# Altium project Marsault1.PrjPcb (part 5 of 7)

## Sheet SENSORS.SchDoc
size A3; SheetNumber: 5; SheetTotal: 9
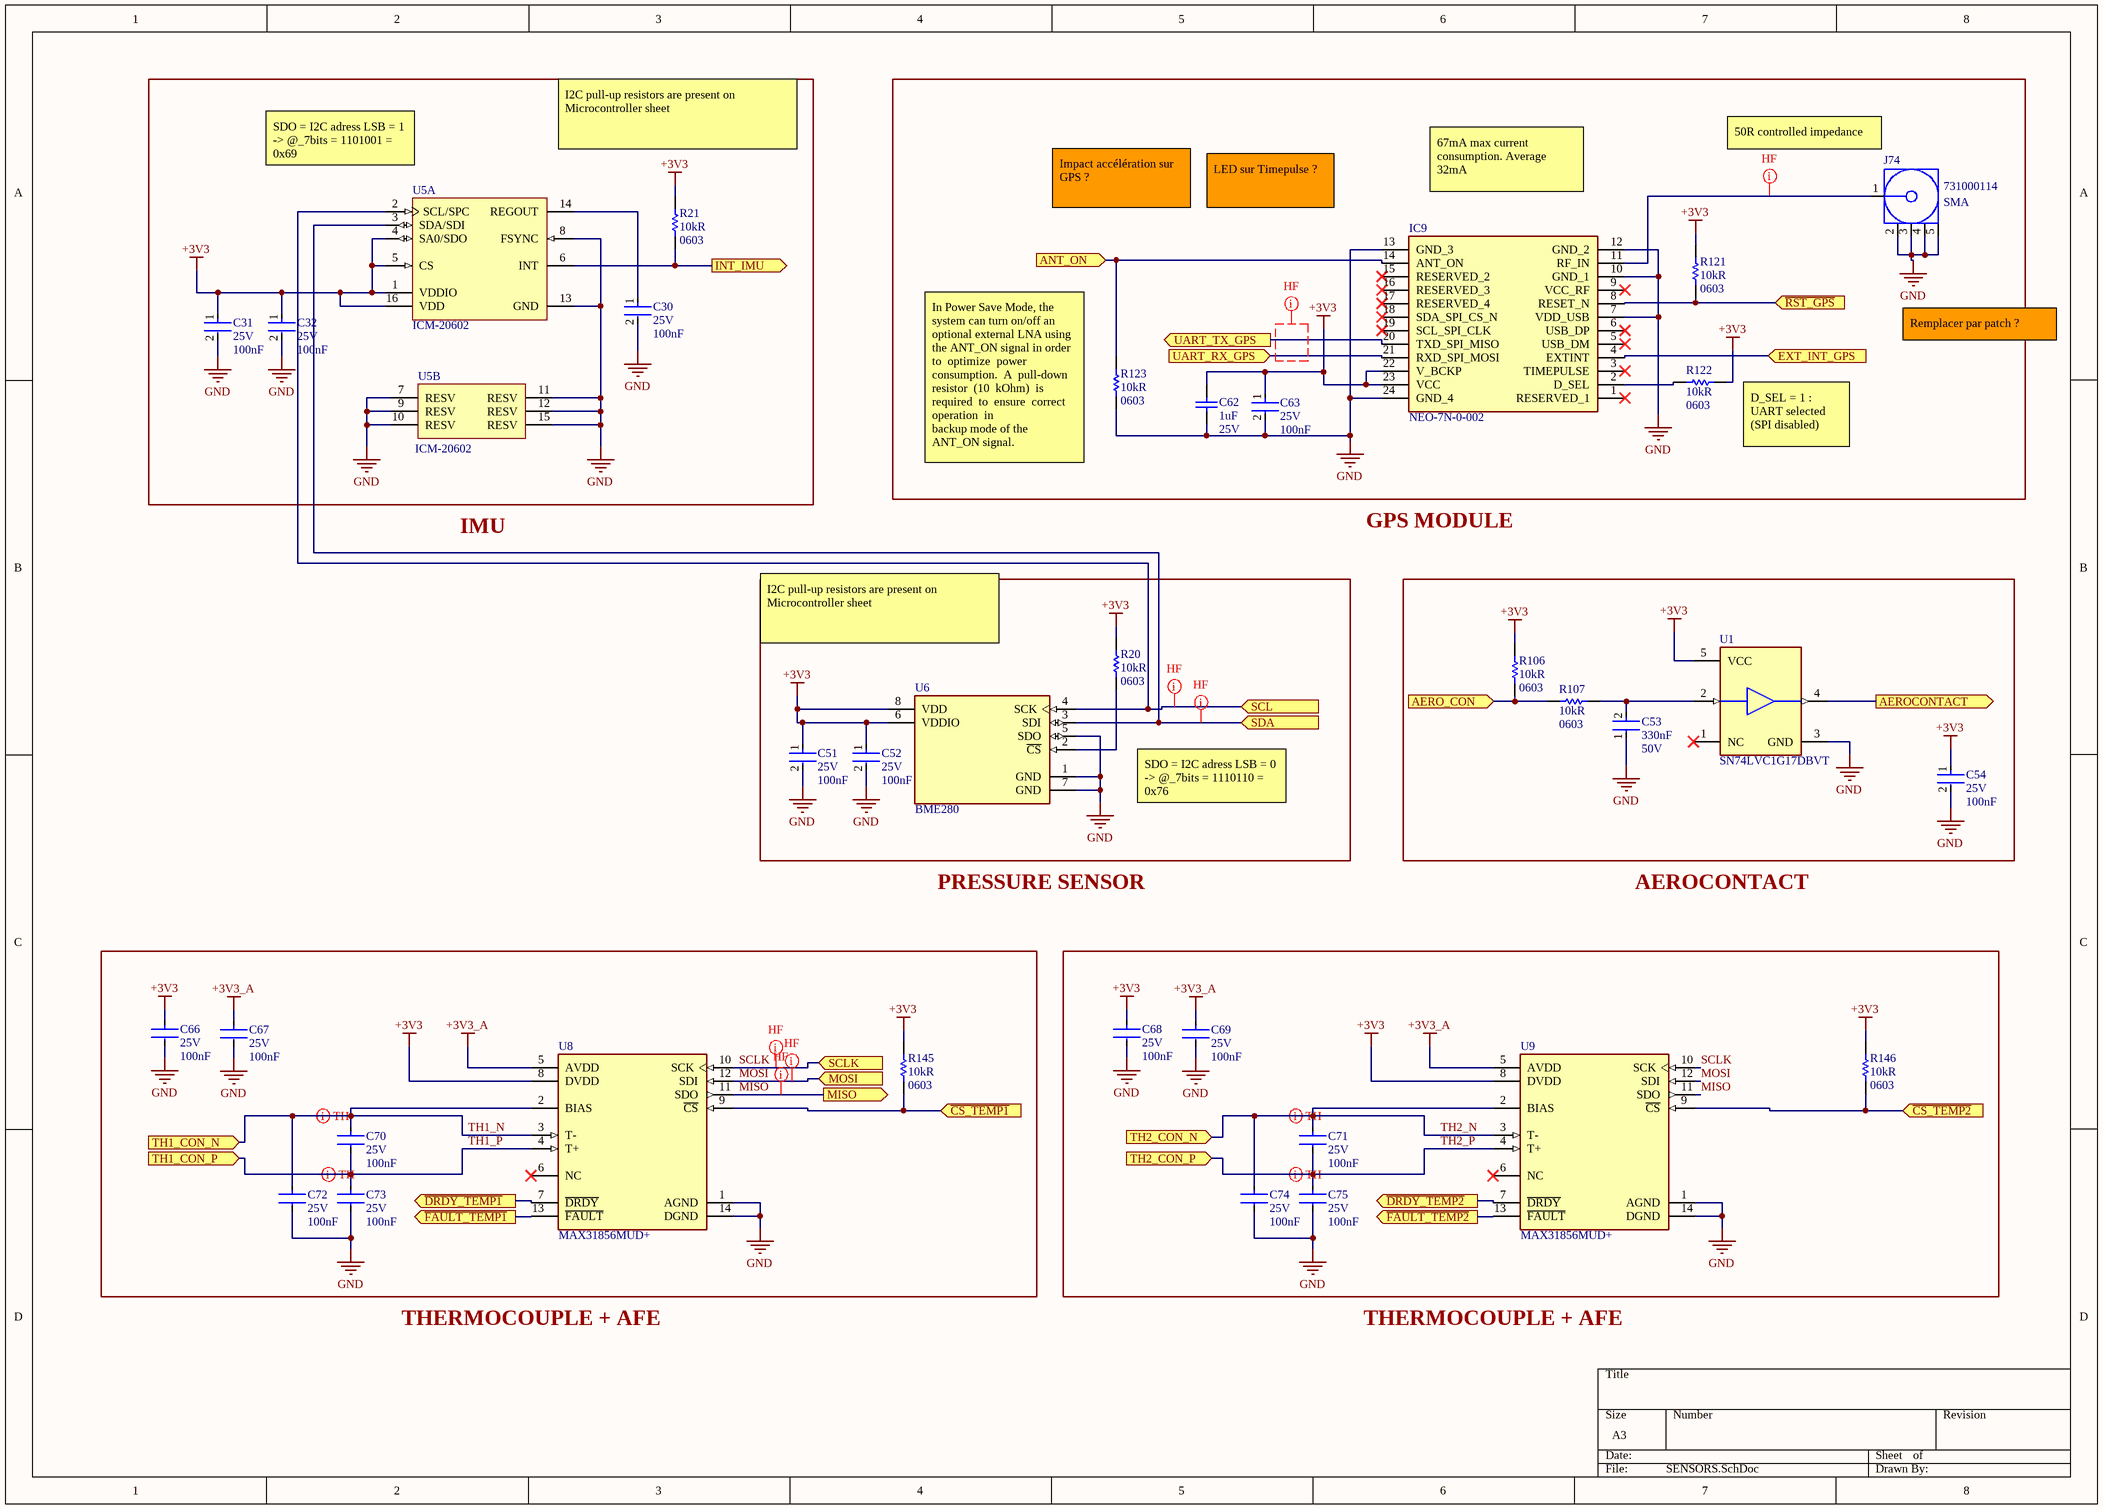
[diagram p4: SENSORS.SchDoc]

### Parts
C30  Voltage Rating (DC): 25V  Capacitance: 100nF  [FP-CGA3E-0_3-0_1-MFG]  (hidden comment: CGA3E2X7R1E104K080AA)
C31  Voltage Rating (DC): 25V  Capacitance: 100nF  [FP-CGA3E-0_3-0_1-MFG]  (hidden comment: CGA3E2X7R1E104K080AA)
C32  Voltage Rating (DC): 25V  Capacitance: 100nF  [FP-CGA3E-0_3-0_1-MFG]  (hidden comment: CGA3E2X7R1E104K080AA)
C51  Voltage Rating (DC): 25V  Capacitance: 100nF  [FP-CGA3E-0_3-0_1-MFG]  (hidden comment: CGA3E2X7R1E104K080AA)
C52  Voltage Rating (DC): 25V  Capacitance: 100nF  [FP-CGA3E-0_3-0_1-MFG]  (hidden comment: CGA3E2X7R1E104K080AA)
C53  Capacitance: 330nF  Voltage Rating: 50V  [FP-C1608-080-0_1-IPC_B]  (hidden comment: C1608X7R1H334K080AC)
C54  Voltage Rating (DC): 25V  Capacitance: 100nF  [FP-CGA3E-0_3-0_1-MFG]  (hidden comment: CGA3E2X7R1E104K080AA)
C62  Capacitance: 1uF  Voltage Rating (DC): 25V  [CAPC1608X90X35LL15T15]  (hidden comment: C0603C105K3PAC7867)
C63  Voltage Rating (DC): 25V  Capacitance: 100nF  [FP-CGA3E-0_3-0_1-MFG]  (hidden comment: CGA3E2X7R1E104K080AA)
C66  Voltage Rating (DC): 25V  Capacitance: 100nF  [FP-CGA3E-0_3-0_1-MFG]  (hidden comment: CGA3E2X7R1E104K080AA)
C67  Voltage Rating (DC): 25V  Capacitance: 100nF  [FP-CGA3E-0_3-0_1-MFG]  (hidden comment: CGA3E2X7R1E104K080AA)
C68  Voltage Rating (DC): 25V  Capacitance: 100nF  [FP-CGA3E-0_3-0_1-MFG]  (hidden comment: CGA3E2X7R1E104K080AA)
C69  Voltage Rating (DC): 25V  Capacitance: 100nF  [FP-CGA3E-0_3-0_1-MFG]  (hidden comment: CGA3E2X7R1E104K080AA)
C70  Voltage Rating (DC): 25V  Capacitance: 100nF  [FP-CGA3E-0_3-0_1-MFG]  (hidden comment: CGA3E2X7R1E104K080AA)
C71  Voltage Rating (DC): 25V  Capacitance: 100nF  [FP-CGA3E-0_3-0_1-MFG]  (hidden comment: CGA3E2X7R1E104K080AA)
C72  Voltage Rating (DC): 25V  Capacitance: 100nF  [FP-CGA3E-0_3-0_1-MFG]  (hidden comment: CGA3E2X7R1E104K080AA)
C73  Voltage Rating (DC): 25V  Capacitance: 100nF  [FP-CGA3E-0_3-0_1-MFG]  (hidden comment: CGA3E2X7R1E104K080AA)
C74  Voltage Rating (DC): 25V  Capacitance: 100nF  [FP-CGA3E-0_3-0_1-MFG]  (hidden comment: CGA3E2X7R1E104K080AA)
C75  Voltage Rating (DC): 25V  Capacitance: 100nF  [FP-CGA3E-0_3-0_1-MFG]  (hidden comment: CGA3E2X7R1E104K080AA)
IC9  NEO-7N-0-002  [NEO7N0002]
J74  731000114  Case/Package: SMA  [MOLX-731000114_V]
R20  Resistance: 10kR  Case Code (Imperial): 0603  [RESC1609X55X30LL15T15]  (hidden comment: ERJ3EKF1002V)
R21  Resistance: 10kR  Case Code (Imperial): 0603  [RESC1609X55X30LL15T15]  (hidden comment: ERJ3EKF1002V)
R106  Resistance: 10kR  Case Code (Imperial): 0603  [RESC1609X55X30LL15T15]  (hidden comment: ERJ3EKF1002V)
R107  Resistance: 10kR  Case Code (Imperial): 0603  [RESC1609X55X30LL15T15]  (hidden comment: ERJ3EKF1002V)
R121  Resistance: 10kR  Case Code (Imperial): 0603  [RESC1609X55X30LL15T15]  (hidden comment: ERJ3EKF1002V)
R122  Resistance: 10kR  Case Code (Imperial): 0603  [RESC1609X55X30LL15T15]  (hidden comment: ERJ3EKF1002V)
R123  Resistance: 10kR  Case Code (Imperial): 0603  [RESC1609X55X30LL15T15]  (hidden comment: ERJ3EKF1002V)
R145  Resistance: 10kR  Case Code (Imperial): 0603  [RESC1609X55X30LL15T15]  (hidden comment: ERJ3EKF1002V)
R146  Resistance: 10kR  Case Code (Imperial): 0603  [RESC1609X55X30LL15T15]  (hidden comment: ERJ3EKF1002V)
U1  SN74LVC1G17DBVT  [FP-DBV0005A-MFG]
U5  ICM-20602  [INSE-I62-16]  (parts A,B of 2)
U6  BME280  [FP-BME280-MFG]
U8  MAX31856MUD+  [FP-U14-2-MFG]
U9  MAX31856MUD+  [FP-U14-2-MFG]

### Ports
AERO_CON (in), AEROCONTACT (out), ANT_ON (in), EXT_INT_GPS (in), INT_IMU (out), MISO (out), MOSI (in), SCL (in), SCLK (in), SDA (in), TH1_CON_N (in), TH1_CON_P (in), TH2_CON_N (in), TH2_CON_P (in), UART_RX_GPS (in), UART_TX_GPS (out), ~{CS_TEMP1} (in), ~{CS_TEMP2} (in), ~{DRDY_TEMP1} (out), ~{DRDY_TEMP2} (out), ~{FAULT_TEMP1} (out), ~{FAULT_TEMP2} (out), ~{RST_GPS} (in)

### Nets
+3V3: C31.1 C32.1 C51.1 C52.1 C54.1 C62.2 C63.1 C66.1 C68.1 IC9.22(V_BCKP) IC9.23(VCC) R20.2 R21.2 R106.2 R121.2 R122.2 R145.2 R146.2 U1.5(VCC) U5.1(VDDIO) U5.4(SA0/SDO) U5.5(CS) U5.16(VDD) U6.6(VDDIO) U6.8(VDD) U8.8(DVDD) U9.8(DVDD)
+3V3_A: C67.1 C69.1 U8.5(AVDD) U9.5(AVDD)
GND: C30.2 C31.2 C32.2 C51.2 C52.2 C53.1 C54.2 C62.1 C63.2 C66.2 C67.2 C68.2 C69.2 C72.2 C73.2 C74.2 C75.2 IC9.7(VDD_USB) IC9.10(GND_1) IC9.12(GND_2) IC9.13(GND_3) IC9.24(GND_4) J74.2 J74.3 J74.4 J74.5 R123.1 U1.3(GND) U5.7(RESV) U5.8(FSYNC) U5.9(RESV) U5.10(RESV) U5.11(RESV) U5.12(RESV) U5.13(GND) U5.15(RESV) U6.1(GND) U6.5(SDO) U6.7(GND) U8.1(AGND) U8.14(DGND) U9.1(AGND) U9.14(DGND)
~{CS_TEMP1}: R145.1 U8.9(~{CS}) ; port ~{CS_TEMP1}
~{CS_TEMP2}: R146.1 U9.9(~{CS}) ; port ~{CS_TEMP2}
~{DRDY_TEMP1}: U8.7(~{DRDY}) ; port ~{DRDY_TEMP1}
~{DRDY_TEMP2}: U9.7(~{DRDY}) ; port ~{DRDY_TEMP2}
~{FAULT_TEMP1}: U8.13(~{FAULT}) ; port ~{FAULT_TEMP1}
~{FAULT_TEMP2}: U9.13(~{FAULT}) ; port ~{FAULT_TEMP2}
AERO_CON: R106.1 R107.2 ; port AERO_CON
AEROCONTACT: U1.4(Y) ; port AEROCONTACT
INT_IMU: R21.1 U5.6(INT) ; port INT_IMU
MISO: U8.11(SDO) U9.11(SDO) ; port MISO
MOSI: U8.12(SDI) U9.12(SDI) ; port MOSI
SCLK: U8.10(SCK) U9.10(SCK) ; port SCLK
TH1_N: C70.1 C72.1 U8.2(BIAS) U8.3(T-) ; port TH1_CON_N  [project net TH1_CON_N]
TH1_P: C70.2 C73.1 U8.4(T+) ; port TH1_CON_P  [project net TH1_CON_P]
TH2_N: C71.1 C74.1 U9.2(BIAS) U9.3(T-) ; port TH2_CON_N  [project net TH2_CON_N]
TH2_P: C71.2 C75.1 U9.4(T+) ; port TH2_CON_P  [project net TH2_CON_P]
NetC30_1: C30.1 U5.14(REGOUT)
NetC53_2: C53.2 R107.1 U1.2(A)
NetIC9_2: IC9.2(D_SEL) R122.1
NetIC9_4: IC9.4(EXTINT) ; port EXT_INT_GPS
NetIC9_8: IC9.8(RESET_N) R121.1 ; port ~{RST_GPS}
NetIC9_11: IC9.11(RF_IN) J74.1
NetIC9_14: IC9.14(ANT_ON) R123.2 ; port ANT_ON
NetIC9_20: IC9.20(TXD_SPI_MISO) ; port UART_TX_GPS
NetIC9_21: IC9.21(RXD_SPI_MOSI) ; port UART_RX_GPS
NetR20_1: R20.1 U6.2(~{CS})
NetR26_2: U5.2(SCL/SPC) U6.4(SCK) ; port SCL
NetR28_2: U5.3(SDA/SDI) U6.3(SDI) ; port SDA

Not connected (* = marked no-connect by the designer): IC9 1(RESERVED_1)* 3(TIMEPULSE)* 5(USB_DM)* 6(USB_DP)* 9(VCC_RF)* 15(RESERVED_2)* 16(RESERVED_3)* 17(RESERVED_4)* 18(SDA_SPI_CS_N)* 19(SCL_SPI_CLK)*; U1 1(NC)*; U8 6(NC)*; U9 6(NC)*

### Layout directives
net class HF: (no net found under the mark), MISO, MOSI, NetIC9_11, NetR26_2, NetR28_2, SCLK
differential pair; differential pair class TH: TH1_CON_N, TH1_CON_P, TH2_CON_N, TH2_CON_P

### Notes on the sheet
- (near U5) SDO = I2C adress LSB = 1 -> @_7bits = 1101001 = 0x69
- I2C pull-up resistors are present on Microcontroller sheet
- (near J74) 50R controlled impedance
- Impact accélération sur GPS ?
- LED sur Timepulse ?
- 67mA max current consumption. Average 32mA
- Remplacer par patch ?
- (near R122) D_SEL = 1 : UART selected (SPI disabled)
- (near R123) In Power Save Mode, the system can turn on/off an optional external LNA using the ANT_ON signal in order
  to  optimize  power  consumption.  A  pull-down  resistor  (10  kOhm)  is  required  to  ensure  correct  operation  in
  backup mode of the ANT_ON signal.
- GPS MODULE
- IMU
- SDO = I2C adress LSB = 0 -> @_7bits = 1110110 = 0x76
- PRESSURE SENSOR
- AEROCONTACT
- THERMOCOUPLE + AFE

### Library data of the parts
C30-C32 C51 C52 C54 C63 C66-C75 = CMP-08246-002186-1: Cap Ceramic 100nF 25V X7R 10% Pad SMD 0603 +125°C Automotive T/R; Manufacturer: TDK; Composition: Ceramic; Dielectric: X7R; Ratings: AEC-Q200; Length: 1.6mm; REACH SVHC: No SVHC; Width: 0.031inch; Packaging: Tape and Reel; Case/Package: 0603; Height: 0.8mm; Termination: SMD/SMT; Max Operating Temperature: 125°C; Thickness: 0.035inch; Case Code (Metric): 1608; Lead Free: Lead Free; Mount: Surface Mount; Voltage Rating: 25V; Tolerance: 10%; Weight: 7.1E-05oz; Min Operating Temperature: -55°C; Package Quantity: 1; Depth: 0.8mm; Case Code (Imperial): 0603; Supplier 1: Mouser; Supplier Part Number 1: 810-CGA3E2X7R1E104K; Manufacturer Part Number: CGA3E2X7R1E104K080AA; RoHS: Yes; Category: Ceramic Capacitors; Stock 1: 488891; Pricing 1: 1=0,12000, 10=0,05600, 50=0,05600, 100=0,02500, 1000=0,01400, 10000=0,01000 (USD); Series: CGA; Resistor Type: Ceramic; RoHS Compliant: Yes; ComponentLink1URL: https://datasheet.ciiva.com/24220/cga3e2x7r1e104k080aa-265934-24220022.pdf?src-supplier=Mouser; ComponentLink1Description: https://datasheet.ciiva.com/24220/cga3e2x7r1e104k080aa-265934-24220022.pdf?src-supplier=Mouser; ComponentLink2URL: https://datasheet.ciiva.com/22725/1735392-22725638.pdf?src-supplier=Element14; ComponentLink2Description: https://datasheet.ciiva.com/22725/1735392-22725638.pdf?src-supplier=Element14; ComponentLink3URL: https://datasheet.ciiva.com/22725/1735392-22725639.pdf?src-supplier=Element14; ComponentLink3Description: https://datasheet.ciiva.com/22725/1735392-22725639.pdf?src-supplier=Element14; ComponentLink4URL: https://datasheet.ciiva.com/16427/mlccspec-automotive-general-midvoltage-en-16427320.pdf?src-supplier=Future+Electronics; ComponentLink4Description: https://datasheet.ciiva.com/16427/mlccspec-automotive-general-midvoltage-en-16427320.pdf?src-supplier=Future+Electronics; ComponentLink5URL: https://datasheet.ciiva.com/23803/1735392-23803082.pdf?src-supplier=Newark; ComponentLink5Description: https://datasheet.ciiva.com/23803/1735392-23803082.pdf?src-supplier=Newark
C53 = CMP-2000-07551-2: Multilayer Ceramic Capacitors 330nF ±10% 50V X7R SMD 0603; Manufacturer: TDK; Case Code (Imperial): 0603; Case Code (Metric): 1608; Dielectric: X7R; Length: 1.6mm; Construction: Flat; Resistor Type: Ceramic; Mount: Surface Mount; Packaging: Tape and Reel; Series: C; Case/Package: 0603; Lead Free: Lead Free; Tolerance: 10%; Voltage: 50V; REACH SVHC: No SVHC; Height: 0.8mm; Weight: 7.1E-05oz; Termination: SMD/SMT; Max Operating Temperature: 125°C; RoHS Compliant: Yes; Min Operating Temperature: -55°C; Depth: 0.8mm; Package Quantity: 1; Thickness: 0.037inch; Voltage Rating (DC): 50V; Dielectric Material: Ceramic; Width: 0.031inch; Supplier 1: Mouser; Supplier Part Number 1: 810-C1608X7R1H334K; Manufacturer Part Number: C1608X7R1H334K080AC; RoHS: Yes; Category: Ceramic Capacitors; Stock 1: 79489; Pricing 1: 1=0,25000, 10=0,11500, 50=0,11500, 100=0,09700, 1000=0,06000, 10000=0,05000 (USD); ComponentLink1URL: https://datasheet.ciiva.com/22718/1796654-22718021.pdf?src-supplier=Element14; ComponentLink1Description: https://datasheet.ciiva.com/22718/1796654-22718021.pdf?src-supplier=Element14; ComponentLink2URL: https://datasheet.ciiva.com/6290/tdkmlcccaprange-6290791.pdf?src-supplier=Digi-Key; ComponentLink2Description: https://datasheet.ciiva.com/6290/tdkmlcccaprange-6290791.pdf?src-supplier=Digi-Key; ComponentLink3URL: https://datasheet.ciiva.com/16427/general-b11-16427753.pdf?src-supplier=Future+Electronics; ComponentLink3Description: https://datasheet.ciiva.com/16427/general-b11-16427753.pdf?src-supplier=Future+Electronics; ComponentLink4URL: https://datasheet.ciiva.com/23803/1735394-23803004.pdf?src-supplier=Newark; ComponentLink4Description: https://datasheet.ciiva.com/23803/1735394-23803004.pdf?src-supplier=Newark; ComponentLink5URL: https://datasheet.ciiva.com/28451/1796654-28451356.pdf?src-supplier=Element14; ComponentLink5Description: https://datasheet.ciiva.com/28451/1796654-28451356.pdf?src-supplier=Element14; ComponentLink6URL: https://datasheet.ciiva.com/6290/tdkmlcccaprange-6290782.pdf?src-supplier=Digi-Key; ComponentLink6Description: https://datasheet.ciiva.com/6290/tdkmlcccaprange-6290782.pdf?src-supplier=Digi-Key
C62 = CMP-2006-02216-2: Manufacturer: Kemet; Manufacturer Part Number: C0603C105K3PACTU; Dielectric Material: Ceramic; Tolerance: 10%; Dielectric: X5R; Part Number: C0603C105K3PAC7867; Supplier 1: Mouser; Supplier Part Number 1: 80-C0603C105K3P; RoHS: Yes; Category: Ceramic Capacitors; Stock 1: 10085; Pricing 1: 1=0,30000, 10=0,15600, 50=0,15600, 100=0,09300, 500=0,08200, 1000=0,07300, 4000=0,05700, 10000=0,05700 (USD); Mount: Surface Mount,PCB; Case/Package: 0603; Number of Pins: 2; Case Code (Imperial): 0603; Case Code (Metric): 1608; Contact Plating: Tin,Matte; Min Operating Temperature: -55°C; Max Operating Temperature: 85°C; Packaging: Tape and Reel; Termination: SMD/SMT; Voltage Rating: 25V; Package Quantity: 4000; Voltage: 25V; Series: C0603C; Construction: Flat; Length: 1.6mm; Width: 0.031inch; Height: 0.8mm; Depth: 0.8mm; Thickness: 0.034inch; Radiation Hardening: No; REACH SVHC: No SVHC; RoHS Compliant: Yes; Lead Free: Lead Free; ComponentLink1URL: https://datasheet.ciiva.com/5998/40889-5998745.pdf?src-supplier=Farnell; ComponentLink1Description: https://datasheet.ciiva.com/5998/40889-5998745.pdf?src-supplier=Farnell; ComponentLink2URL: https://datasheet.ciiva.com/28610/1918694-28610792.pdf?src-supplier=Element14; ComponentLink2Description: https://datasheet.ciiva.com/28610/1918694-28610792.pdf?src-supplier=Element14
IC9 = NEO-7N-0-002: Integrated Circuit; Manufacturer_Name: U-Blox; Datasheet Link: https://www.u-blox.com/sites/default/files/products/documents/NEO-7_DataSheet_%28UBX-13003830%29.pdf; Height: 2.6mm; Manufacturer_Part_Number: NEO-7N-0-002
J74 = CMP-2000-05487-1: SMA Right-Angle PCB Jack Receptacle, Brass Body, Gold Plated, 50 Ohm, 5-Pin THD, RoHS, Tray; Manufacturer: Molex; Manufacturer Part Number: 73100-0114; Dielectric Material: PTFE; Polarity: Normal; Impedance: 50R; Connector Type: SMA,PCB,Coaxial; Gender: Female; Frequency: 12Hz; Max Frequency: 18GHz; Voltage Rating: 500V; Operating Frequency: 0 to 12 GHz; Datasheet Version: 09/2016; Package Description: 5-Pin Through Hole Device, Body 14.8 x 6.35 mm, Pitch 2.54 mm; Datasheet URL: http://www.molex.com/webdocs/datasheets/pdf/en-us/0731000114_RF_COAX_CONNECTORS.pdf; Manufacturer URL: http://www.molex.com/; Package Reference: 731000114; Mounting Technology: ThroughHole; Package URL: http://www.molex.com/pdm_docs/sd/731000114_sd.pdf; Supplier 1: Mouser; Supplier Part Number 1: 538-73100-0114; RoHS: Yes; Category: RF / Coaxial Connectors; Stock 1: 639; Pricing 1: 1=5,69000, 10=5,01000, 50=5,01000, 100=3,99000, 500=3,88000, 1000=3,31000, 2500=3,07000, 5000=2,95000, 10000=2,84000 (USD); Mount: Through Hole; Contact Plating: Gold; Contact Material: Copper; Body Material: Brass; Body Plating: Gold; Insulation Material: Teflon; Housing Color: Gold; Plating: Gold; Center Contact Plating: Gold; Min Operating Temperature: -65°C; Max Operating Temperature: 165°C; Package Quantity: 1760; Packaging: Tray; Series: 73100; Termination: Solder; Orientation: Right Angle; Fastening Type: Threaded; Length: 14.8mm; Radiation Hardening: No; REACH SVHC: Unknown; ComponentLink1URL: https://datasheet.ciiva.com/7996/1596725-7996452.pdf?src-supplier=Element14; ComponentLink1Description: https://datasheet.ciiva.com/7996/1596725-7996452.pdf?src-supplier=Element14; ComponentLink2URL: https://datasheet.ciiva.com/30104/82220731000114-rf-coax-nectors-30104097.pdf?src-supplier=Onlinecomponents.com; ComponentLink2Description: https://datasheet.ciiva.com/30104/82220731000114-rf-coax-nectors-30104097.pdf?src-supplier=Onlinecomponents.com; ComponentLink3URL: https://datasheet.ciiva.com/26945/getdatasheetpartid-152702-26945396.pdf?src-supplier=Verical; ComponentLink3Description: https://datasheet.ciiva.com/26945/getdatasheetpartid-152702-26945396.pdf?src-supplier=Verical
R20 R21 R106 R107 R121-R123 R145 R146 = CMP-1012-00623-3: Chip Resistor, 10 KOhm, +/- 1%, 0.1 W, -55 to 155 degC, 0603 (1608 Metric), RoHS, Tape and Reel; Manufacturer: Panasonic; Manufacturer Part Number: ERJ-3EKF1002V; Voltage Rating: 75V; Power Rating: 100mW; Temperature Coefficient: 100ppm\/degreesC; Case\/Package: 0603; Number of Pins: 2; Package Reference: 603; Depth: 0.8mm; Mount: SurfaceMount; Package Description: 2-Pin Surface Mount Device, Body 1.6 x 0.85 mm; Datasheet Version: 02/2017; Length: 1.6mm; Lead Free: LeadFree; Height: 0.45mm; Number of Terminations: 2; Max Power Dissipation: 100mW; Min Operating Temperature: -55degC; Datasheet URL: https://industrial.panasonic.com/cdbs/www-data/pdf/RDA0000/AOA0000C304.pdf; Termination: SMD/SMT; Case Code (Metric): 1608; Tolerance: 1%; Max Operating Temperature: 155degC; RoHSCompliant: true; Voltage Rating (DC): 75V; Radiation Hardening: No; Packaging: TapeandReel; Composition: ThickFilm; Mounting Technology: SurfaceMount; Manufacturer URL: http://www.panasonic.com/; Width: 0.031inch; REACH SVHC: NoSVHC; Contact Plating: Tin; Military Standard: Not; Package Quantity: 1; Supplier 1: Mouser; Supplier Part Number 1: 667-ERJ-3EKF1002V; RoHS: Yes; Category: Chip SMD Resistors; Stock 1: 20455; Pricing 1: 1=0,10000, 10=0,04000, 50=0,04000, 100=0,01700, 1000=0,00700, 5000=0,00500, 10000=0,00500 (USD); Case/Package: 0603; Size Code: 0603; Resistor Type: Thick Film; Series: ERJ; Resistance Tolerance: 1%; Construction: Rectangular; Features: Automotive AEC-Q200; Technology: THICK FILM; RoHS Compliant: Yes; ComponentLink1URL: https://datasheet.ciiva.com/16511/aoa0000ce2-16511861.pdf?src-supplier=Avnet+Asia; ComponentLink1Description: https://datasheet.ciiva.com/16511/aoa0000ce2-16511861.pdf?src-supplier=Avnet+Asia; ComponentLink2URL: https://datasheet.ciiva.com/46372/1678782-46372725.pdf?src-supplier=Element14; ComponentLink2Description: https://datasheet.ciiva.com/46372/1678782-46372725.pdf?src-supplier=Element14; ComponentLink3URL: https://datasheet.ciiva.com/28514/426256-28514198.pdf?src-supplier=Element14; ComponentLink3Description: https://datasheet.ciiva.com/28514/426256-28514198.pdf?src-supplier=Element14; ComponentLink4URL: https://datasheet.ciiva.com/9194/aoa0000ce2-9194199.pdf?src-supplier=Avnet; ComponentLink4Description: https://datasheet.ciiva.com/9194/aoa0000ce2-9194199.pdf?src-supplier=Avnet; ComponentLink5URL: https://datasheet.ciiva.com/7830/aoa0000ce2-7830729.pdf?src-supplier=Element14; ComponentLink5Description: https://datasheet.ciiva.com/7830/aoa0000ce2-7830729.pdf?src-supplier=Element14; ComponentLink6URL: https://datasheet.ciiva.com/17212/aoa0000ce2-17212105.pdf?src-supplier=Avnet+Europe; ComponentLink6Description: https://datasheet.ciiva.com/17212/aoa0000ce2-17212105.pdf?src-supplier=Avnet+Europe; ComponentLink7URL: https://datasheet.ciiva.com/30208/aoa0000ce2-30208985.pdf?src-supplier=Onlinecomponents.com; ComponentLink7Description: https://datasheet.ciiva.com/30208/aoa0000ce2-30208985.pdf?src-supplier=Onlinecomponents.com; ComponentLink8URL: https://datasheet.ciiva.com/48530/aoa0000ce2-48530988.pdf?src-supplier=Avnet; ComponentLink8Description: https://datasheet.ciiva.com/48530/aoa0000ce2-48530988.pdf?src-supplier=Avnet; ComponentLink9URL: https://datasheet.ciiva.com/24070/aoa0000ce2-24070318.pdf?src-supplier=Mouser; ComponentLink9Description: https://datasheet.ciiva.com/24070/aoa0000ce2-24070318.pdf?src-supplier=Mouser; ComponentLink10URL: https://datasheet.ciiva.com/16759/70260748-16759807.pdf?src-supplier=Allied+Electronics; ComponentLink10Description: https://datasheet.ciiva.com/16759/70260748-16759807.pdf?src-supplier=Allied+Electronics
U1 = CMP-0859-00041-5: IC BUF NON-INVERT 5.5V SOT23-5; Manufacturer: Texas Instruments; Number Of Circuits: 1; Logic Function Desc: Non-Inverting; Standoff Height: 0mm; Propagation Delay: 4.6ns; Min Supply Voltage: 1.65V; Nominal Supply Current: 10uA; Category: IC; Height: 1.45mm; Manufacturer Part Number: SN74LVC1G17DBVT; Temperature Range High: +125°C; Device Class L2: Logic ICs; Temperature: -40°C to +125°C; Temperature Range Low: -40°C; Device Class L3: Buffers; Package: DBV0005A; Max Supply Voltage: 5.5V; Ambient Temperature Range High: +125°C; Number Of Outputs: 1; Device Class L1: Integrated Circuits (ICs); ComponentLink2URL: http://www.ti.com/lit/ds/symlink/sn74lvc1g17.pdf; Octopart: https://octopart.com/sn74lvc1g17dbvt-texas+instruments-2326350; Number Of Inputs: 1; Ambient Temperature Range Low: -40°C; ComponentLink2Description: Datasheet; Digikey Description: IC BUF NON-INVERT 5.5V SOT23-5; Lead Free: Yes; Automotive: No; RoHS: TRUE; Mouser Description: Buffers & Line Drivers SNGL Schmitt Trigger Buffer
U5 = CMP-2000-07589-1: High Performance 6-Axis MEMS MotionTracking(TM) Device, 1.71 to 3.45 V, -40 to 85 degC, 16-Pin LGA, RoHS; Manufacturer: InvenSense; Sensor Type: Temperature; Output Type: I2C; RoHSCompliant: True; Datasheet Version: Rev. 1.0, 10/2016; Datasheet URL: http://www.invensense.com/wp-content/uploads/2016/10/DS-000176-ICM-20602-v1.0.pdf; Min Operating Temperature: -40degC; Mounting Technology: SurfaceMount; Max Operating Temperature: 85degC; Manufacturer URL: http://www.invensense.com/; Package Reference: I62-16; Package Description: 16-Pin Land Grid Array, Body 3 x 3 mm, Pitch 0.5 mm
U6 = CMP-2000-05073-3: SENSOR PRESSURE HUMIDITY TEMP; Sensor Type: Temperature; Accuracy: 3%; Response Time: 1s; Output Type: SPI; Min Operating Temperature: -40°C; Max Operating Temperature: 85°C; Case/Package: LGA; Packaging: Cut Tape; Mount: Surface Mount; Lead Free: Lead Free; Number of Pins: 8
U8 U9 = CMP-05752-000010-1: IC CONV THERMOCOUPLE 14TSSOP; Operating Supply Current: 1.2mA; Min Supply Voltage: 3V; Max Supply Voltage: 3.6V; Output Type: Digital; Interface: SPI; Min Operating Temperature: -55°C; Max Operating Temperature: 125°C; Case/Package: TSSOP; Mount: Surface Mount; Packaging: Rail/Tube; Number of Pins: 14

## Sheet MOTOR.SchDoc
size A2; SheetNumber: 6; SheetTotal: 9
Used 4 times, as channels MOTOR1, MOTOR2, MOTOR3, MOTOR4. Parts and nets are listed once, with the designators drawn on the sheet.
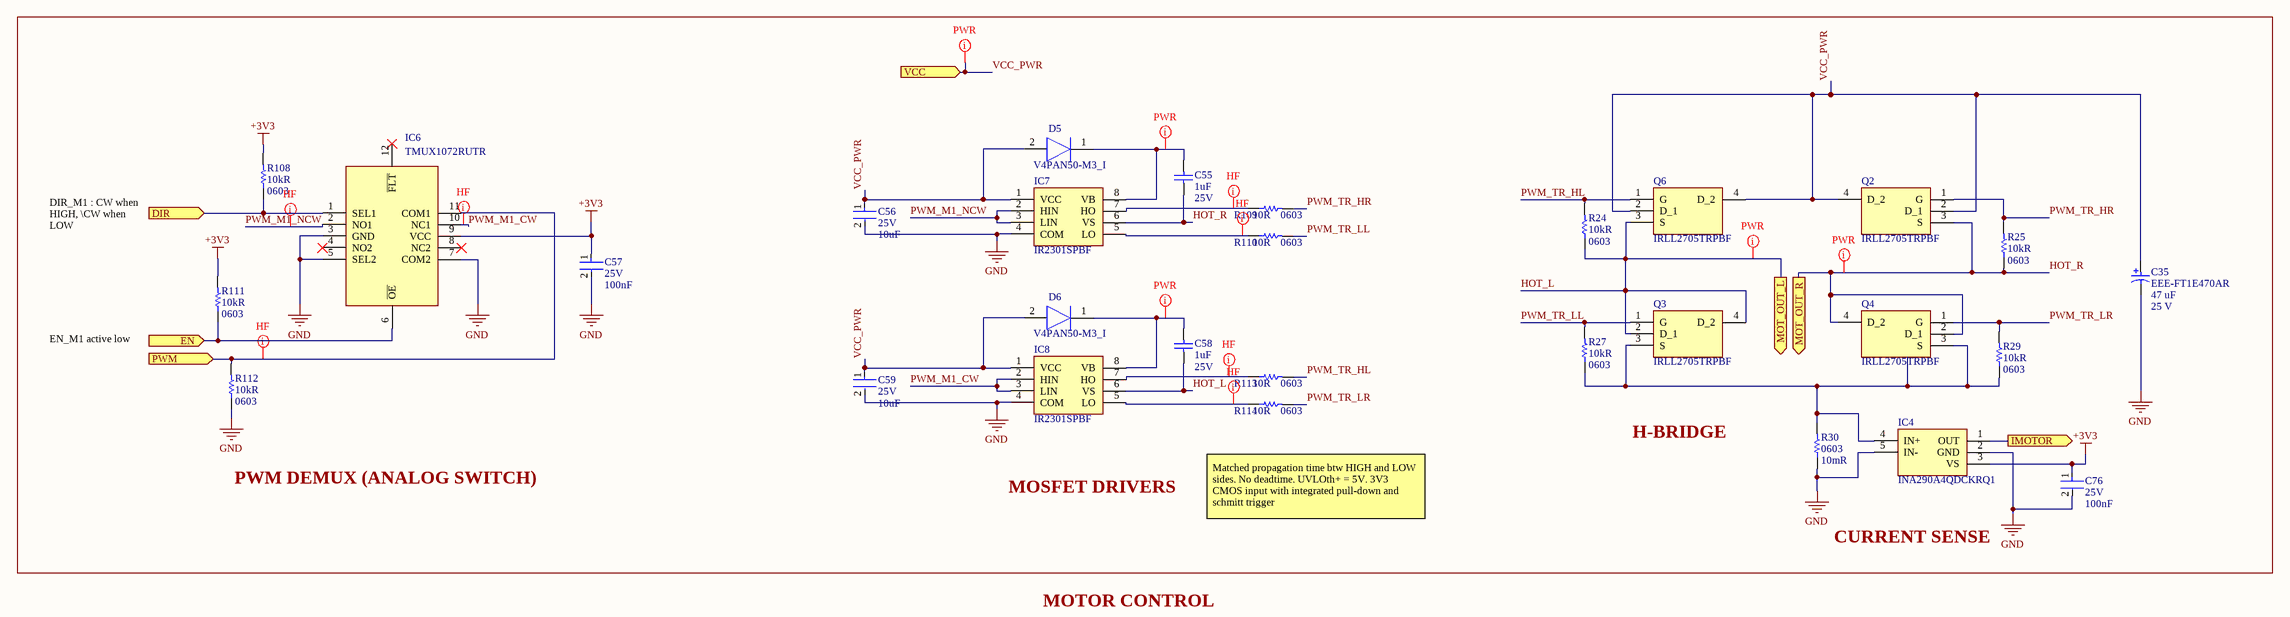
[diagram p5: MOTOR.SchDoc]

### Parts
C35  EEE-FT1E470AR  Cap.: 47 uF  Rated Voltage: 25 V  [PNSC-FT-V-53x53-2_V]
C55  Capacitance: 1uF  Voltage Rating (DC): 25V  [CAPC1608X90X35LL15T15]  (hidden comment: C0603C105K3PAC7867)
C56  Voltage Rating (DC): 25V  Capacitance: 10uF  [FP-C2012-125-0_2-IPC_B]  (hidden comment: C2012X5R1E106K125AB)
C57  Voltage Rating (DC): 25V  Capacitance: 100nF  [FP-CGA3E-0_3-0_1-MFG]  (hidden comment: CGA3E2X7R1E104K080AA)
C58  Capacitance: 1uF  Voltage Rating (DC): 25V  [CAPC1608X90X35LL15T15]  (hidden comment: C0603C105K3PAC7867)
C59  Voltage Rating (DC): 25V  Capacitance: 10uF  [FP-C2012-125-0_2-IPC_B]  (hidden comment: C2012X5R1E106K125AB)
C76  Voltage Rating (DC): 25V  Capacitance: 100nF  [FP-CGA3E-0_3-0_1-MFG]  (hidden comment: CGA3E2X7R1E104K080AA)
D5  V4PAN50-M3_I  [V4PAN50M3I]
D6  V4PAN50-M3_I  [V4PAN50M3I]
IC4  INA290A4QDCKRQ1  [SOT65P210X110-5N]
IC6  TMUX1072RUTR  [QFN40P170X200X55-12N]
IC7  IR2301SPBF  [SOIC127P600X175-8N]
IC8  IR2301SPBF  [SOIC127P600X175-8N]
Q2  IRLL2705TRPBF  [SOT230P700X180-4N]
Q3  IRLL2705TRPBF  [SOT230P700X180-4N]
Q4  IRLL2705TRPBF  [SOT230P700X180-4N]
Q6  IRLL2705TRPBF  [SOT230P700X180-4N]
R24  Resistance: 10kR  Case Code (Imperial): 0603  [RESC1609X55X30LL15T15]  (hidden comment: ERJ3EKF1002V)
R25  Resistance: 10kR  Case Code (Imperial): 0603  [RESC1609X55X30LL15T15]  (hidden comment: ERJ3EKF1002V)
R27  Resistance: 10kR  Case Code (Imperial): 0603  [RESC1609X55X30LL15T15]  (hidden comment: ERJ3EKF1002V)
R29  Resistance: 10kR  Case Code (Imperial): 0603  [RESC1609X55X30LL15T15]  (hidden comment: ERJ3EKF1002V)
R30  Case Code (Imperial): 0603  Resistance: 10mR  [RESC1508X46X38ML25T25]  (hidden comment: WSL0603R0100FEA)
R108  Resistance: 10kR  Case Code (Imperial): 0603  [RESC1609X55X30LL15T15]  (hidden comment: ERJ3EKF1002V)
R109  Case/Package: 0603  Resistance: 10R  [RESC1608X55X25NL10T15]  (hidden comment: RC0603FR-0710RL)
R110  Case/Package: 0603  Resistance: 10R  [RESC1608X55X25NL10T15]  (hidden comment: RC0603FR-0710RL)
R111  Resistance: 10kR  Case Code (Imperial): 0603  [RESC1609X55X30LL15T15]  (hidden comment: ERJ3EKF1002V)
R112  Resistance: 10kR  Case Code (Imperial): 0603  [RESC1609X55X30LL15T15]  (hidden comment: ERJ3EKF1002V)
R113  Case/Package: 0603  Resistance: 10R  [RESC1608X55X25NL10T15]  (hidden comment: RC0603FR-0710RL)
R114  Case/Package: 0603  Resistance: 10R  [RESC1608X55X25NL10T15]  (hidden comment: RC0603FR-0710RL)

### Ports
DIR (in), EN (in), IMOTOR (out), MOT_OUT_L (out), MOT_OUT_R (out), PWM (in), VCC (in)

### Nets
+3V3: C57.1 C76.1 IC4.3(VS) IC6.9(VCC) R108.2 R111.2
GND: C35.2 C56.2 C57.2 C59.2 C76.2 IC4.2(GND) IC4.5(IN-) IC6.3(GND) IC6.5(SEL2) IC6.7(COM2) IC7.4(COM) IC8.4(COM) R30.1 R112.1
DIR: IC6.1(SEL1) R108.1 ; port DIR
EN: IC6.6(~{OE}) R111.1 ; port EN
HOT_L: C58.1 IC8.6(VS) Q3.2(D_1) Q3.4(D_2) Q6.3(S) R24.1 ; port MOT_OUT_L
HOT_R: C55.1 IC7.6(VS) Q2.3(S) Q4.2(D_1) Q4.4(D_2) R25.1 ; port MOT_OUT_R
IMOTOR: IC4.1(OUT) ; port IMOTOR
PWM: IC6.11(COM1) R112.2 ; port PWM
PWM_M1_CW: IC6.10(NC1) IC8.2(HIN) IC8.3(LIN)
PWM_M1_NCW: IC6.2(NO1) IC7.2(HIN) IC7.3(LIN)
PWM_TR_HL: Q6.1(G) R24.2 R113.2
PWM_TR_HR: Q2.1(G) R25.2 R109.2
PWM_TR_LL: Q3.1(G) R27.2 R110.2
PWM_TR_LR: Q4.1(G) R29.2 R114.2
VCC_PWR: C35.1 C56.1 C59.1 D5.2(A) D6.2(A) IC7.1(VCC) IC8.1(VCC) Q2.2(D_1) Q2.4(D_2) Q6.2(D_1) Q6.4(D_2) ; port VCC
NetC55_2: C55.2 D5.1(K) IC7.8(VB)
NetC58_2: C58.2 D6.1(K) IC8.8(VB)
NetIC4_4: IC4.4(IN+) Q3.3(S) Q4.3(S) R27.1 R29.1 R30.2
NetIC7_5: IC7.5(LO) R110.1
NetIC7_7: IC7.7(HO) R109.1
NetIC8_5: IC8.5(LO) R114.1
NetIC8_7: IC8.7(HO) R113.1

Not connected (* = marked no-connect by the designer): IC6 4(NO2)* 8(NC2)* 12(~{FLT})*

### Channels
MOTOR1: designators end in _MOTOR1; ports DIR=DIR_M1 EN=EN_M1 IMOTOR=IMOTOR1 MOT_OUT_L=HOT_L MOT_OUT_R=HOT_R PWM=PWM_M1 VCC=VCC_PWR
MOTOR2: designators end in _MOTOR2; ports DIR=DIR_M2 EN=EN_M2 IMOTOR=IMOTOR2 MOT_OUT_L=HOT_L MOT_OUT_R=HOT_R PWM=PWM_M2 VCC=VCC_PWR
MOTOR3: designators end in _MOTOR3; ports DIR=DIR_M3 EN=EN_M3 IMOTOR=IMOTOR3 MOT_OUT_L=HOT_L MOT_OUT_R=HOT_R PWM=PWM_M3 VCC=VCC_PWR
MOTOR4: designators end in _MOTOR4; ports DIR=DIR_M4 EN=EN_M4 IMOTOR=IMOTOR4 MOT_OUT_L=HOT_L MOT_OUT_R=HOT_R PWM=NetIC6_MOTOR4_11 VCC=VCC_PWR

### Layout directives
net class PWR: HOT_L, HOT_R, NetC55_MOTOR1_2, NetC58_MOTOR1_2, VCC_PWR
net class HF: NetIC7_MOTOR1_5, NetIC7_MOTOR1_7, NetIC8_MOTOR1_5, NetIC8_MOTOR1_7, PWM_M1, PWM_M1_CW_MOTOR1, PWM_M1_NCW_MOTOR1

### Notes on the sheet
- DIR_M1 : CW when HIGH, \CW when LOW
- EN_M1 active low
- H-BRIDGE
- PWM DEMUX (ANALOG SWITCH)
- MOSFET DRIVERS
- Matched propagation time btw HIGH and LOW sides. No deadtime. UVLOth+ = 5V. 3V3 CMOS input with integrated pull-down and schmitt trigger
- CURRENT SENSE
- MOTOR CONTROL

### Library data of the parts
C35 = CMP-0744-00003-1: Aluminum Electrolytic Capacitor, 47 uF +/- 20%, 25 V, -55 to 105 degC, 2-Pin 5.3 x 5.3 x 6.1 mm SMD, RoHS, Tape and Reel; Manufacturer: Panasonic; Ripple Current: 240 mA; Capacitance Tolerance: +/- 20%; ComponentLink3Description: Package Specification; RoHS: TRUE; PackageReference: FT-V-53x53-2; PartNumber: EEE-FT1E470AR; DatasheetVersion: Mar-14; Temp. Range: -55 to 105 degC; ComponentLink2URL: http://industrial.panasonic.com/www-data/pdf/ABA0000/ABA0000CE135.pdf; PackageDescription: 2-Pin SMD, Body 5.3 x 5.3 mm, Height 6.1 mm; ComponentLink3URL: http://industrial.panasonic.com/www-data/pdf/ABA0000/ABA0000PE248.pdf; Mounting Technology: Surface Mount; ComponentLink2Description: Datasheet; ComponentLink1URL: http://www.panasonic.com/industrial/electronic-components/; PackageVersion: Feb-14; Packing: Tape and Reel; ComponentLink1Description: Manufacturer URL
C55 C58 = CMP-2006-02216-2: as C62 on sheet SENSORS; Part Number: C0603C105K3PAC7867; Supplier 1: Mouser; Supplier Part Number 1: 80-C0603C105K3P; RoHS: Yes; Category: Ceramic Capacitors; Stock 1: 10085; Pricing 1: 1=0,30000, 10=0,15600, 50=0,15600, 100=0,09300, 500=0,08200, 1000=0,07300, 4000=0,05700, 10000=0,05700 (USD); Mount: Surface Mount,PCB; Case/Package: 0603; Number of Pins: 2; Case Code (Imperial): 0603; Case Code (Metric): 1608; Contact Plating: Tin,Matte; Min Operating Temperature: -55°C; Max Operating Temperature: 85°C; Packaging: Tape and Reel; Termination: SMD/SMT; Voltage Rating: 25V; Package Quantity: 4000; Voltage: 25V; Series: C0603C; Construction: Flat; Length: 1.6mm; Width: 0.031inch; Height: 0.8mm; Depth: 0.8mm; Thickness: 0.034inch; Radiation Hardening: No; REACH SVHC: No SVHC; RoHS Compliant: Yes; Lead Free: Lead Free; ComponentLink1URL: https://datasheet.ciiva.com/5998/40889-5998745.pdf?src-supplier=Farnell; ComponentLink1Description: https://datasheet.ciiva.com/5998/40889-5998745.pdf?src-supplier=Farnell; ComponentLink2URL: https://datasheet.ciiva.com/28610/1918694-28610792.pdf?src-supplier=Element14; ComponentLink2Description: https://datasheet.ciiva.com/28610/1918694-28610792.pdf?src-supplier=Element14
C56 C59 = CMP-08246-002675-1: Multilayer Ceramic Capacitors 10μF ±10% 25V X5R SMD 0805; Manufacturer: TDK; Packaging: Tape and Reel; Dielectric: X5R; Case/Package: 0805; Lead Free: Lead Free; Dielectric Material: Ceramic; Series: C; Termination: SMD/SMT; Voltage: 25V; Depth: 1.25mm; Max Operating Temperature: 85°C; Resistor Type: Ceramic; Weight: 0.000194oz; Case Code (Metric): 2012; Height: 1.25mm; Mount: Surface Mount; Voltage Rating: 25V; Length: 2mm; REACH SVHC: No SVHC; Min Operating Temperature: -55°C; Case Code (Imperial): 0805; Thickness: 0.057inch; Width: 0.049inch; Tolerance: 10%; Package Quantity: 1; Supplier 1: Mouser; Supplier Part Number 1: 810-C2012X5R1E106K; Manufacturer Part Number: C2012X5R1E106K125AB; RoHS: Yes; Category: Ceramic Capacitors; Stock 1: 75897; Pricing 1: 1=0,34000, 10=0,24100, 50=0,24100, 100=0,14400, 1000=0,09100, 10000=0,08800 (USD); ComponentLink1URL: https://datasheet.ciiva.com/22725/1913358-22725561.pdf?src-supplier=Element14; ComponentLink1Description: https://datasheet.ciiva.com/22725/1913358-22725561.pdf?src-supplier=Element14; ComponentLink2URL: https://datasheet.ciiva.com/16394/general-b11-16394044.pdf?src-supplier=Future+Electronics; ComponentLink2Description: https://datasheet.ciiva.com/16394/general-b11-16394044.pdf?src-supplier=Future+Electronics; ComponentLink3URL: https://datasheet.ciiva.com/24216/mlcc-commercial-general-en-24216237.pdf?src-supplier=Mouser; ComponentLink3Description: https://datasheet.ciiva.com/24216/mlcc-commercial-general-en-24216237.pdf?src-supplier=Mouser
C57 C76 = CMP-08246-002186-1: as C30-C32 on sheet SENSORS; Composition: Ceramic; Dielectric: X7R; Ratings: AEC-Q200; Length: 1.6mm; REACH SVHC: No SVHC; Width: 0.031inch; Packaging: Tape and Reel; Case/Package: 0603; Height: 0.8mm; Termination: SMD/SMT; Max Operating Temperature: 125°C; Thickness: 0.035inch; Case Code (Metric): 1608; Lead Free: Lead Free; Mount: Surface Mount; Voltage Rating: 25V; Tolerance: 10%; Weight: 7.1E-05oz; Min Operating Temperature: -55°C; Package Quantity: 1; Depth: 0.8mm; Case Code (Imperial): 0603; Supplier 1: Mouser; Supplier Part Number 1: 810-CGA3E2X7R1E104K; Manufacturer Part Number: CGA3E2X7R1E104K080AA; RoHS: Yes; Category: Ceramic Capacitors; Stock 1: 488891; Pricing 1: 1=0,12000, 10=0,05600, 50=0,05600, 100=0,02500, 1000=0,01400, 10000=0,01000 (USD); Series: CGA; Resistor Type: Ceramic; RoHS Compliant: Yes; ComponentLink1URL: https://datasheet.ciiva.com/24220/cga3e2x7r1e104k080aa-265934-24220022.pdf?src-supplier=Mouser; ComponentLink1Description: https://datasheet.ciiva.com/24220/cga3e2x7r1e104k080aa-265934-24220022.pdf?src-supplier=Mouser; ComponentLink2URL: https://datasheet.ciiva.com/22725/1735392-22725638.pdf?src-supplier=Element14; ComponentLink2Description: https://datasheet.ciiva.com/22725/1735392-22725638.pdf?src-supplier=Element14; ComponentLink3URL: https://datasheet.ciiva.com/22725/1735392-22725639.pdf?src-supplier=Element14; ComponentLink3Description: https://datasheet.ciiva.com/22725/1735392-22725639.pdf?src-supplier=Element14; ComponentLink4URL: https://datasheet.ciiva.com/16427/mlccspec-automotive-general-midvoltage-en-16427320.pdf?src-supplier=Future+Electronics; ComponentLink4Description: https://datasheet.ciiva.com/16427/mlccspec-automotive-general-midvoltage-en-16427320.pdf?src-supplier=Future+Electronics; ComponentLink5URL: https://datasheet.ciiva.com/23803/1735392-23803082.pdf?src-supplier=Newark; ComponentLink5Description: https://datasheet.ciiva.com/23803/1735392-23803082.pdf?src-supplier=Newark
D5 D6 = V4PAN50-M3_I: Diode; Manufacturer_Name: Vishay; Manufacturer_Part_Number: V4PAN50-M3/I; Datasheet Link: http://www.farnell.com/datasheets/2158732.pdf; Height: 1mm; Mouser Part Number: 78-V4PAN50-M3/I; Mouser Price/Stock: https://www.mouser.co.uk/ProductDetail/Vishay-General-Semiconductor/V4PAN50-M3-I?qs=r0jnxPZtNpqb%252BFSSnAKIyA%3D%3D; Arrow Part Number: V4PAN50-M3/I; Arrow Price/Stock: https://www.arrow.com/en/products/v4pan50-m3i/vishay?region=nac
IC4 = INA290A4QDCKRQ1: Integrated Circuit; Manufacturer_Name: Texas Instruments; Datasheet Link: https://www.ti.com/lit/gpn/INA290-Q1; Height: 1.1mm; Manufacturer_Part_Number: INA290A4QDCKRQ1; Mouser Part Number: 595-INA290A4QDCKRQ1; Mouser Price/Stock: https://www.mouser.co.uk/ProductDetail/Texas-Instruments/INA290A4QDCKRQ1?qs=eP2BKZSCXI5u8rewO66qig%3D%3D; Arrow Part Number: INA290A4QDCKRQ1; Arrow Price/Stock: https://www.arrow.com/en/products/ina290a4qdckrq1/texas-instruments?region=nac
IC6 = TMUX1072RUTR: Integrated Circuit; Manufacturer_Name: Texas Instruments; Datasheet Link: http://www.ti.com/lit/gpn/tmux1072; Height: 0.55mm; Manufacturer_Part_Number: TMUX1072RUTR; Mouser Part Number: 595-TMUX1072RUTR; Mouser Price/Stock: https://www.mouser.co.uk/ProductDetail/Texas-Instruments/TMUX1072RUTR?qs=w%2Fv1CP2dgqp1ghU2rNl24g%3D%3D; Arrow Part Number: TMUX1072RUTR; Arrow Price/Stock: https://www.arrow.com/en/products/tmux1072rutr/texas-instruments
IC7 IC8 = IR2301SPBF: Integrated Circuit; Manufacturer_Name: Infineon; Datasheet Link: https://www.infineon.com/dgdl/ir2301.pdf?fileId=5546d462533600a4015355c97bb216dc; Height: 1.75mm; Manufacturer_Part_Number: IR2301SPBF; Mouser Part Number: 942-IR2301SPBF; Mouser Price/Stock: https://www.mouser.co.uk/ProductDetail/Infineon-IR/IR2301SPBF?qs=dQmlx5f5cRI9WSlcvq46eg%3D%3D; Arrow Part Number: IR2301SPBF; Arrow Price/Stock: https://www.arrow.com/en/products/ir2301spbf/infineon-technologies-ag
Q2-Q4 Q6 = IRLL2705TRPBF: MOSFET (N-Channel); Manufacturer_Name: Infineon; Datasheet Link: https://ms.componentsearchengine.com/Datasheets/2/IRLL2705TRPBF.pdf; Height: 1.8mm; Manufacturer_Part_Number: IRLL2705TRPBF; Mouser Part Number: 942-IRLL2705TRPBF; Mouser Price/Stock: https://www.mouser.co.uk/ProductDetail/Infineon-IR/IRLL2705TRPBF?qs=9%252BKlkBgLFf1DHv3vNo9CMA%3D%3D; Arrow Part Number: IRLL2705TRPBF; Arrow Price/Stock: https://www.arrow.com/en/products/irll2705trpbf/infineon-technologies-ag
R24 R25 R27 R29 R108 R111 R112 = CMP-1012-00623-3: as R20 on sheet SENSORS; Case\/Package: 0603; Number of Pins: 2; Package Reference: 603; Depth: 0.8mm; Mount: SurfaceMount; Package Description: 2-Pin Surface Mount Device, Body 1.6 x 0.85 mm; Datasheet Version: 02/2017; Length: 1.6mm; Lead Free: LeadFree; Height: 0.45mm; Number of Terminations: 2; Max Power Dissipation: 100mW; Min Operating Temperature: -55degC; Datasheet URL: https://industrial.panasonic.com/cdbs/www-data/pdf/RDA0000/AOA0000C304.pdf; Termination: SMD/SMT; Case Code (Metric): 1608; Tolerance: 1%; Max Operating Temperature: 155degC; RoHSCompliant: true; Voltage Rating (DC): 75V; Radiation Hardening: No; Packaging: TapeandReel; Composition: ThickFilm; Mounting Technology: SurfaceMount; Manufacturer URL: http://www.panasonic.com/; Width: 0.031inch; REACH SVHC: NoSVHC; Contact Plating: Tin; Military Standard: Not; Package Quantity: 1; Supplier 1: Mouser; Supplier Part Number 1: 667-ERJ-3EKF1002V; RoHS: Yes; Category: Chip SMD Resistors; Stock 1: 20455; Pricing 1: 1=0,10000, 10=0,04000, 50=0,04000, 100=0,01700, 1000=0,00700, 5000=0,00500, 10000=0,00500 (USD); Case/Package: 0603; Size Code: 0603; Resistor Type: Thick Film; Series: ERJ; Resistance Tolerance: 1%; Construction: Rectangular; Features: Automotive AEC-Q200; Technology: THICK FILM; RoHS Compliant: Yes; ComponentLink1URL: https://datasheet.ciiva.com/16511/aoa0000ce2-16511861.pdf?src-supplier=Avnet+Asia; ComponentLink1Description: https://datasheet.ciiva.com/16511/aoa0000ce2-16511861.pdf?src-supplier=Avnet+Asia; ComponentLink2URL: https://datasheet.ciiva.com/46372/1678782-46372725.pdf?src-supplier=Element14; ComponentLink2Description: https://datasheet.ciiva.com/46372/1678782-46372725.pdf?src-supplier=Element14; ComponentLink3URL: https://datasheet.ciiva.com/28514/426256-28514198.pdf?src-supplier=Element14; ComponentLink3Description: https://datasheet.ciiva.com/28514/426256-28514198.pdf?src-supplier=Element14; ComponentLink4URL: https://datasheet.ciiva.com/9194/aoa0000ce2-9194199.pdf?src-supplier=Avnet; ComponentLink4Description: https://datasheet.ciiva.com/9194/aoa0000ce2-9194199.pdf?src-supplier=Avnet; ComponentLink5URL: https://datasheet.ciiva.com/7830/aoa0000ce2-7830729.pdf?src-supplier=Element14; ComponentLink5Description: https://datasheet.ciiva.com/7830/aoa0000ce2-7830729.pdf?src-supplier=Element14; ComponentLink6URL: https://datasheet.ciiva.com/17212/aoa0000ce2-17212105.pdf?src-supplier=Avnet+Europe; ComponentLink6Description: https://datasheet.ciiva.com/17212/aoa0000ce2-17212105.pdf?src-supplier=Avnet+Europe; ComponentLink7URL: https://datasheet.ciiva.com/30208/aoa0000ce2-30208985.pdf?src-supplier=Onlinecomponents.com; ComponentLink7Description: https://datasheet.ciiva.com/30208/aoa0000ce2-30208985.pdf?src-supplier=Onlinecomponents.com; ComponentLink8URL: https://datasheet.ciiva.com/48530/aoa0000ce2-48530988.pdf?src-supplier=Avnet; ComponentLink8Description: https://datasheet.ciiva.com/48530/aoa0000ce2-48530988.pdf?src-supplier=Avnet; ComponentLink9URL: https://datasheet.ciiva.com/24070/aoa0000ce2-24070318.pdf?src-supplier=Mouser; ComponentLink9Description: https://datasheet.ciiva.com/24070/aoa0000ce2-24070318.pdf?src-supplier=Mouser; ComponentLink10URL: https://datasheet.ciiva.com/16759/70260748-16759807.pdf?src-supplier=Allied+Electronics; ComponentLink10Description: https://datasheet.ciiva.com/16759/70260748-16759807.pdf?src-supplier=Allied+Electronics
R30 = CMP-2000-03799-1: Manufacturer: Vishay Dale; Tolerance: 1%; Temperature Coefficient: 75ppm/°C; Power Rating: 100mW; Part Number: WSL0603R0100FEA; Supplier 1: Mouser; Supplier Part Number 1: 71-WSL0603R0100FEA; Manufacturer Part Number: WSL0603R0100FEA; RoHS: No; Category: Chip SMD Resistors; Stock 1: 418; Pricing 1: 1=1,03000, 10=0,76500, 50=0,76500, 100=0,47100, 1000=0,39000, 5000=0,37200, 10000=0,37200 (USD); Case/Package: 0603; Number of Pins: 2; Case Code (Metric): 1608; Weight: 7.1E-05oz; Contact Plating: Tin,Matte; Min Operating Temperature: -65°C; Max Operating Temperature: 170°C; Packaging: Tape and Reel; Resistor Type: Metal Element,Metal Strip; Package Quantity: 1; Number of Terminations: 2; Termination: SMD/SMT; Max Power Dissipation: 100mW; Features: Moisture Resistant; Length: 0.06inch; Width: 0.03inch; Height: 0.33mm; Depth: 0.76mm; Radiation Hardening: No; Lead Free: Lead Free; REACH SVHC: Unknown; ComponentLink1URL: https://datasheet.ciiva.com/7791/1598296-7791987.pdf?src-supplier=Element14; ComponentLink1Description: https://datasheet.ciiva.com/7791/1598296-7791987.pdf?src-supplier=Element14; ComponentLink2URL: https://datasheet.ciiva.com/2482/wsl-2482914.pdf?src-supplier=Digi-Key; ComponentLink2Description: https://datasheet.ciiva.com/2482/wsl-2482914.pdf?src-supplier=Digi-Key; ComponentLink3URL: https://datasheet.ciiva.com/2482/wsl-2482915.pdf?src-supplier=Digi-Key; ComponentLink3Description: https://datasheet.ciiva.com/2482/wsl-2482915.pdf?src-supplier=Digi-Key; ComponentLink4URL: https://datasheet.ciiva.com/2482/wsl-2482916.pdf?src-supplier=Digi-Key; ComponentLink4Description: https://datasheet.ciiva.com/2482/wsl-2482916.pdf?src-supplier=Digi-Key; ComponentLink5URL: https://datasheet.ciiva.com/9049/wsl-9049413.pdf?src-supplier=Avnet; ComponentLink5Description: https://datasheet.ciiva.com/9049/wsl-9049413.pdf?src-supplier=Avnet; ComponentLink6URL: https://datasheet.ciiva.com/5469/wsl-101914-5469241.pdf?src-supplier=Mouser; ComponentLink6Description: https://datasheet.ciiva.com/5469/wsl-101914-5469241.pdf?src-supplier=Mouser; ComponentLink7URL: https://datasheet.ciiva.com/17189/wsl-17189978.pdf?src-supplier=Avnet+Europe; ComponentLink7Description: https://datasheet.ciiva.com/17189/wsl-17189978.pdf?src-supplier=Avnet+Europe; ComponentLink8URL: https://datasheet.ciiva.com/28621/1911169-28621724.pdf?src-supplier=Element14; ComponentLink8Description: https://datasheet.ciiva.com/28621/1911169-28621724.pdf?src-supplier=Element14; ComponentLink9URL: https://datasheet.ciiva.com/16510/wsl-16510141.pdf?src-supplier=Future+Electronics; ComponentLink9Description: https://datasheet.ciiva.com/16510/wsl-16510141.pdf?src-supplier=Future+Electronics; ComponentLink10URL: https://datasheet.ciiva.com/28621/1911169-28621725.pdf?src-supplier=Element14; ComponentLink10Description: https://datasheet.ciiva.com/28621/1911169-28621725.pdf?src-supplier=Element14; ComponentLink11URL: https://datasheet.ciiva.com/16755/70205438-16755071.pdf?src-supplier=Allied+Electronics; ComponentLink11Description: https://datasheet.ciiva.com/16755/70205438-16755071.pdf?src-supplier=Allied+Electronics
R109 R110 R113 R114 = CMP-1659-00008-4: Chip Resistor, 10 Ohm, +/- 1%, 0.1 W, -55 to 155 degC, 0603 (1608 Metric), RoHS, Tape and Reel; Manufacturer: Yageo; Voltage Rating: 50 V; Power Rating: 100mW; Temperature Coefficient: 200ppm/°C; Voltage Rating (DC): 50V; PackageReference: 0603; ComponentLink3Description: Package Specification; Packaging: Tape and Reel; Max Operating Temperature: 155 degC; ComponentLink3URL: http://www.farnell.com/datasheets/443971.pdf; PackageDescription: 2-Pin Surface Mount Device, Body 1.6 x 0.8 mm; ComponentLink1URL: http://www.yageo.com/; Pins: 2; REACH SVHC: No SVHC; RoHSCompliant: true; ComponentLink2URL: http://www.yageo.com/documents/recent/PYu-RC_Group_51_RoHS_L_04.pdf; DatasheetVersion: Rev. 4, 02/2016; Mount: Surface Mount; Package Quantity: 200; Min Operating Temperature: -55 degC; Height: 0.45 mm; Mounting Technology: Surface Mount; ComponentLink1Description: Manufacturer URL; ComponentLink2Description: Datasheet; Length: 1.6 mm; Supplier 1: Mouser; Supplier Part Number 1: 603-RC0603FR-0710RL; Manufacturer Part Number: RC0603FR-0710RL; RoHS: Yes; Category: Chip SMD Resistors; Stock 1: 256429; Pricing 1: 1=0,10000, 10=0,04800, 50=0,04800, 100=0,02000, 1000=0,00800, 5000=0,00600, 10000=0,00400 (USD); Number of Pins: 2; Case Code (Imperial): 0603; Case Code (Metric): 1608; Contact Plating: Tin,Matte; Size Code: 0603; Tolerance: 1%; Termination: SMD/SMT; Resistor Type: Thick Film; Features: Moisture Resistant; Series: RC; Max Power Dissipation: 100mW; Number of Terminations: 2; Resistance Tolerance: 1%; Construction: Rectangular; Technology: THICK FILM; Width: 0.8mm; Depth: 0.8mm; Radiation Hardening: No; Military Standard: Not; RoHS Compliant: Yes; Lead Free: Lead Free; ComponentLink4URL: https://datasheet.ciiva.com/11808/0900766b80f96399-11808140.pdf?src-supplier=RSComponents; ComponentLink4Description: https://datasheet.ciiva.com/11808/0900766b80f96399-11808140.pdf?src-supplier=RSComponents; ComponentLink5URL: https://datasheet.ciiva.com/7746/443971-7746245.pdf?src-supplier=Element14; ComponentLink5Description: https://datasheet.ciiva.com/7746/443971-7746245.pdf?src-supplier=Element14; ComponentLink6URL: https://datasheet.ciiva.com/8891/pyu-rc0603-51-rohs-l-4-8891285.pdf?src-supplier=Avnet; ComponentLink6Description: https://datasheet.ciiva.com/8891/pyu-rc0603-51-rohs-l-4-8891285.pdf?src-supplier=Avnet; ComponentLink7URL: https://datasheet.ciiva.com/28386/pyu-rc0603-51-rohs-l-4-28386637.pdf?src-supplier=Avnet+Europe; ComponentLink7Description: https://datasheet.ciiva.com/28386/pyu-rc0603-51-rohs-l-4-28386637.pdf?src-supplier=Avnet+Europe